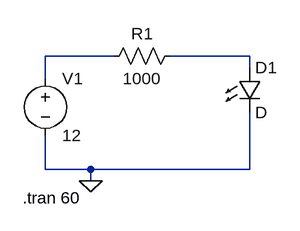
[diagram p0: schematic Draft3W 3.asc]
Draft3W 3.asc, the LTspice schematic file:
Version 4.1
SHEET 1 880 680
WIRE 80 112 -16 112
WIRE 272 112 160 112
WIRE 272 128 272 112
WIRE -16 144 -16 112
WIRE -16 272 -16 224
WIRE 48 272 -16 272
WIRE 272 272 272 192
WIRE 272 272 48 272
WIRE 48 288 48 272
FLAG 48 288 0
SYMBOL voltage -16 128 R0
SYMATTR InstName V1
SYMATTR Value 12
SYMBOL res 176 96 R90
WINDOW 0 0 56 VBottom 2
WINDOW 3 32 56 VTop 2
SYMATTR InstName R1
SYMATTR Value 1000
SYMBOL LED 256 128 R0
SYMATTR InstName D1
TEXT -48 312 Left 2 !.tran 60

The netlist it stands for:
* Draft3W 3.asc
V1 N001 0 12
R1 N002 N001 1000
D1 N002 0 D
.model D D
.lib standard.dio
.tran 60
.backanno
.end